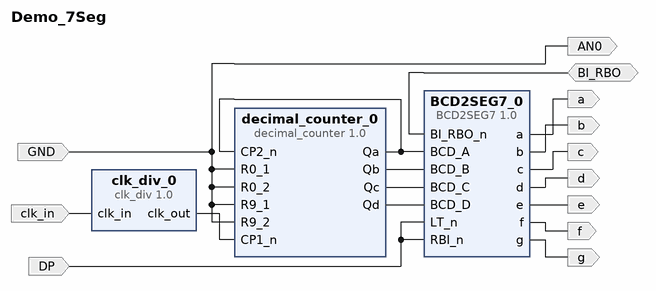
[diagram p0: block diagram of the top level]
# Vivado block design Demo_7Seg, Vivado 2015.3
create_bd_design Demo_7Seg

create_bd_port -dir I clk_in
create_bd_port -dir I DP
create_bd_port -dir I GND
create_bd_port -dir O AN0
create_bd_port -dir O a
create_bd_port -dir O b
create_bd_port -dir O c
create_bd_port -dir O d
create_bd_port -dir O e
create_bd_port -dir O f
create_bd_port -dir O g
create_bd_port -dir IO BI_RBO

create_bd_cell -type ip -vlnv xilinx.com:xup:BCD2SEG7:1.0 BCD2SEG7_0
create_bd_cell -type ip -vlnv xilinx.com:xup:decimal_counter:1.0 decimal_counter_0
create_bd_cell -type ip -vlnv xilinx.com:xup:clk_div:1.0 clk_div_0
set_property -dict {CONFIG.N 99999999} [get_bd_cells clk_div_0]

# ---- connections ----

connect_bd_net [get_bd_ports clk_in] [get_bd_pins clk_div_0/clk_in]
connect_bd_net [get_bd_ports DP] [get_bd_pins BCD2SEG7_0/LT_n] [get_bd_pins BCD2SEG7_0/RBI_n]
connect_bd_net [get_bd_ports GND] \
  [get_bd_ports AN0] [get_bd_pins decimal_counter_0/R9_1] [get_bd_pins decimal_counter_0/R9_2] \
  [get_bd_pins decimal_counter_0/R0_1] [get_bd_pins decimal_counter_0/R0_2]
connect_bd_net [get_bd_pins BCD2SEG7_0/a] [get_bd_ports a]
connect_bd_net [get_bd_pins BCD2SEG7_0/b] [get_bd_ports b]
connect_bd_net [get_bd_pins BCD2SEG7_0/c] [get_bd_ports c]
connect_bd_net [get_bd_pins BCD2SEG7_0/d] [get_bd_ports d]
connect_bd_net [get_bd_pins BCD2SEG7_0/e] [get_bd_ports e]
connect_bd_net [get_bd_pins BCD2SEG7_0/f] [get_bd_ports f]
connect_bd_net [get_bd_pins BCD2SEG7_0/g] [get_bd_ports g]
connect_bd_net [get_bd_ports BI_RBO] [get_bd_pins BCD2SEG7_0/BI_RBO_n]
connect_bd_net [get_bd_pins decimal_counter_0/Qa] [get_bd_pins BCD2SEG7_0/BCD_A] [get_bd_pins decimal_counter_0/CP2_n]
connect_bd_net [get_bd_pins decimal_counter_0/Qb] [get_bd_pins BCD2SEG7_0/BCD_B]
connect_bd_net [get_bd_pins decimal_counter_0/Qc] [get_bd_pins BCD2SEG7_0/BCD_C]
connect_bd_net [get_bd_pins decimal_counter_0/Qd] [get_bd_pins BCD2SEG7_0/BCD_D]
connect_bd_net [get_bd_pins clk_div_0/clk_out] [get_bd_pins decimal_counter_0/CP1_n]

validate_bd_design
save_bd_design
